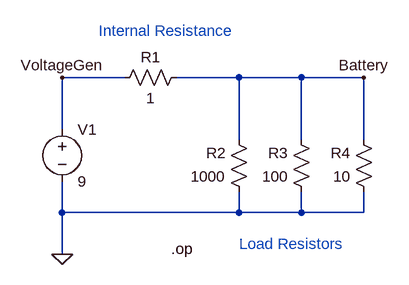
[diagram p0: schematic NV_SPICE_12.asc]
NV_SPICE_12.asc, the LTspice schematic file:
Version 4
SHEET 1 880 680
WIRE 176 48 80 48
WIRE 352 48 256 48
WIRE 448 48 352 48
WIRE 544 48 448 48
WIRE 80 128 80 48
WIRE 352 144 352 48
WIRE 448 144 448 48
WIRE 544 144 544 48
WIRE 80 256 80 208
WIRE 352 256 352 224
WIRE 352 256 80 256
WIRE 448 256 448 224
WIRE 448 256 352 256
WIRE 544 256 544 224
WIRE 544 256 448 256
WIRE 80 320 80 256
FLAG 80 320 0
FLAG 80 48 VoltageGen
FLAG 544 48 Battery
SYMBOL voltage 80 112 R0
WINDOW 123 0 0 Left 0
WINDOW 39 0 0 Left 0
SYMATTR InstName V1
SYMATTR Value 9
SYMBOL res 272 32 R90
WINDOW 0 0 56 VBottom 0
WINDOW 3 32 56 VTop 0
SYMATTR InstName R1
SYMATTR Value 1
SYMBOL res 368 240 R180
WINDOW 0 36 76 Left 0
WINDOW 3 36 40 Left 0
SYMATTR InstName R2
SYMATTR Value 1000
SYMBOL res 464 240 R180
WINDOW 0 36 76 Left 0
WINDOW 3 36 40 Left 0
SYMATTR InstName R3
SYMATTR Value 100
SYMBOL res 560 240 R180
WINDOW 0 36 76 Left 0
WINDOW 3 36 40 Left 0
SYMATTR InstName R4
SYMATTR Value 10
TEXT 248 312 Left 0 !.op
TEXT 136 -24 Left 0 ;Internal Resistance
TEXT 352 304 Left 0 ;Load Resistors

The netlist it stands for:
* NV_SPICE_12.asc
V1 VoltageGen 0 9
R1 Battery VoltageGen 1
R2 0 Battery 1000
R3 0 Battery 100
R4 0 Battery 10
.op
* Internal Resistance
* Load Resistors
.backanno
.end